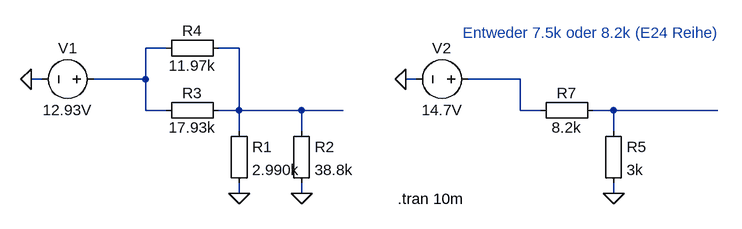
[diagram p0: schematic volt-div.asc]
volt-div.asc, the LTspice schematic file:
Version 4
SHEET 1 880 680
WIRE -48 -16 -80 -16
WIRE 64 -16 32 -16
WIRE -240 32 -256 32
WIRE -80 32 -80 -16
WIRE -80 32 -160 32
WIRE 336 32 320 32
WIRE 496 32 416 32
WIRE -80 80 -80 32
WIRE -48 80 -80 80
WIRE 64 80 64 -16
WIRE 64 80 32 80
WIRE 160 80 64 80
WIRE 224 80 160 80
WIRE 496 80 496 32
WIRE 528 80 496 80
WIRE 640 80 608 80
WIRE 800 80 640 80
WIRE 64 112 64 80
WIRE 160 112 160 80
WIRE 640 112 640 80
WIRE 64 208 64 192
WIRE 160 208 160 192
WIRE 640 208 640 192
FLAG -256 32 0
FLAG 64 208 0
FLAG 160 208 0
FLAG 320 32 0
FLAG 640 208 0
SYMBOL Misc\\EuropeanResistor 48 96 R0
SYMATTR InstName R1
SYMATTR Value 2.990k
SYMATTR SpiceLine tol=5
SYMBOL Misc\\EuropeanResistor 144 96 R0
SYMATTR InstName R2
SYMATTR Value 38.8k
SYMATTR SpiceLine tol=10
SYMBOL Misc\\EuropeanResistor 48 64 R90
WINDOW 0 5 56 VBottom 2
WINDOW 3 27 56 VTop 2
SYMATTR InstName R3
SYMATTR Value 17.93k
SYMATTR SpiceLine tol=10
SYMBOL Misc\\EuropeanResistor 48 -32 R90
WINDOW 0 5 56 VBottom 2
WINDOW 3 27 56 VTop 2
SYMATTR InstName R4
SYMATTR Value 11.97k
SYMATTR SpiceLine tol=5
SYMBOL voltage -144 32 R90
WINDOW 0 -32 56 VBottom 2
WINDOW 3 32 56 VTop 2
WINDOW 123 0 0 Left 2
WINDOW 39 0 0 Left 2
SYMATTR InstName V1
SYMATTR Value 12.93V
SYMBOL Misc\\EuropeanResistor 624 96 R0
SYMATTR InstName R5
SYMATTR Value 3k
SYMBOL Misc\\EuropeanResistor 624 64 R90
WINDOW 0 5 56 VBottom 2
WINDOW 3 27 56 VTop 2
SYMATTR InstName R7
SYMATTR Value 8.2k
SYMBOL voltage 432 32 R90
WINDOW 0 -32 56 VBottom 2
WINDOW 3 32 56 VTop 2
WINDOW 123 0 0 Left 2
WINDOW 39 0 0 Left 2
SYMATTR InstName V2
SYMATTR Value 14.7V
TEXT 308 216 Left 2 !.tran 10m
TEXT 408 -40 Left 2 ;Entweder 7.5k oder 8.2k (E24 Reihe)

The netlist it stands for:
* volt-div.asc
R1 N002 0 2.990k tol=5
R2 N002 0 38.8k tol=10
R3 N002 N001 17.93k tol=10
R4 N002 N001 11.97k tol=5
V1 N001 0 12.93V
R5 N004 0 3k
R7 N004 N003 8.2k
V2 N003 0 14.7V
.tran 10m
* Entweder 7.5k oder 8.2k (E24 Reihe)
.backanno
.end